# EAGLE schematic module (EAGLE 7.2.0)
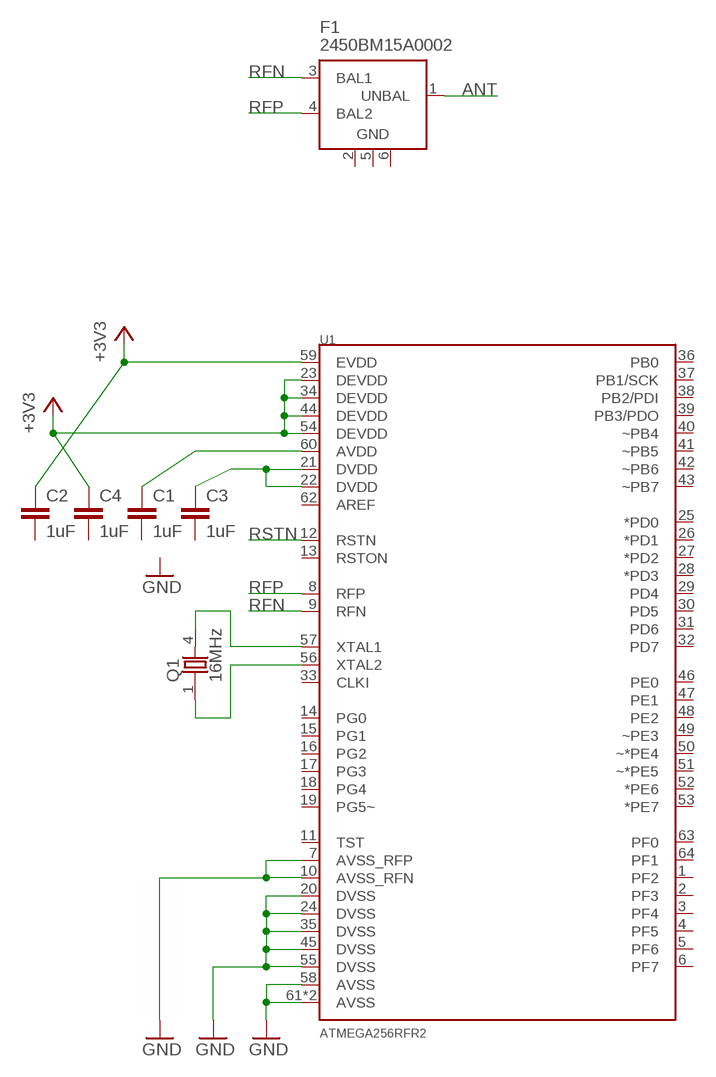
[diagram p0: schematic, sheet 1]

## Parts
C1  1uF  C-EUC0805K  [C0805K]
C2  1uF  C-EUC0805K  [C0805K]
C3  1uF  C-EUC0805K  [C0805K]
C4  1uF  C-EUC0805K  [C0805K]
F1  2450BM15A0002  [2450BM15A0002]
Q1  16MHz  86SMX  [86SMX]
U1  ATMEGA256RFR2  [QFN-64]

## Nets
+3V3: C2.1 C4.1 U1.23(DEVDD) U1.34(DEVDD) U1.44(DEVDD) U1.54(DEVDD) U1.59(EVDD)
ANT: F1.1(UNBAL)
GND: U1.7(AVSS_RFP) U1.10(AVSS_RFN) U1.20(DVSS) U1.24(DVSS) U1.35(DVSS) U1.45(DVSS) U1.55(DVSS) U1.58(AVSS) U1.61(AVSS) U1.PADDLE(AVSS)
N$1: C3.1 U1.21(DVDD) U1.22(DVDD)
N$2: C1.1 U1.60(AVDD)
N$3: Q1.4 U1.57(XTAL1)
N$4: Q1.1 U1.56(XTAL2)
RFN: F1.3(BAL1) U1.9(RFN)
RFP: F1.4(BAL2) U1.8(RFP)
RSTN: U1.12(RSTN)
Unconnected: C1.2 C2.2 C3.2 C4.2 F1.2(GND) F1.5(GND) F1.6(GND) U1.1(PF2) U1.2(PF3) U1.3(PF4) U1.4(PF5) U1.5(PF6) U1.6(PF7) U1.11(TST) U1.13(RSTON) U1.14(PG0) U1.15(PG1) U1.16(PG2) U1.17(PG3) U1.18(PG4) U1.19(PG5~) U1.25(*PD0) U1.26(*PD1) U1.27(*PD2) U1.28(*PD3) U1.29(PD4) U1.30(PD5) U1.31(PD6) U1.32(PD7) U1.33(CLKI) U1.36(PB0) U1.37(PB1/SCK) U1.38(PB2/PDI) U1.39(PB3/PDO) U1.40(~PB4) U1.41(~PB5) U1.42(~PB6) U1.43(~PB7) U1.46(PE0) U1.47(PE1) U1.48(PE2) U1.49(~PE3) U1.50(~*PE4) U1.51(~*PE5) U1.52(*PE6) U1.53(*PE7) U1.62(AREF) U1.63(PF0) U1.64(PF1)

## Library data of the parts
C1-C4 = rcl:C-EU: CAPACITOR, European symbol
F1 = RFR2:2450BM15A0002: 2.45 GHz Impedance Matched Balun-Filter For TI CC253X/CC2540 Chipset family Data sheet <http://www.johansontechnology.com/images/stories/ip/baluns/balun_filter_combo_matched_2450bm15a0002_v8.pdf>
Q1 = crystal:86SMX: CRYSTAL; MF: C-MAC FREQUENCY PRODUCTS LTD; MPN: XTAL003321- 86SMX; OC_FARNELL: 6344914; OC_NEWARK: 01H9866
U1 = RFR2:ATMEGA256RFR2